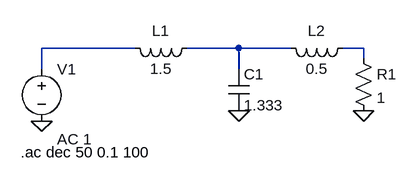
[diagram p0: schematic Circuito1.asc]
Circuito1.asc, the LTspice schematic file:
Version 4
SHEET 1 880 680
WIRE 176 96 32 96
WIRE 336 96 256 96
WIRE 416 96 336 96
WIRE 528 96 496 96
WIRE 528 112 528 96
WIRE 32 128 32 96
WIRE 336 128 336 96
FLAG 32 208 0
FLAG 336 192 0
FLAG 528 192 0
SYMBOL voltage 32 112 R0
WINDOW 123 24 124 Left 2
WINDOW 39 0 0 Left 0
SYMATTR Value2 AC 1
SYMATTR InstName V1
SYMATTR Value ""
SYMBOL ind 272 80 R90
WINDOW 0 5 56 VBottom 2
WINDOW 3 32 56 VTop 2
SYMATTR InstName L1
SYMATTR Value 1.5
SYMBOL ind 512 80 R90
WINDOW 0 5 56 VBottom 2
WINDOW 3 32 56 VTop 2
SYMATTR InstName L2
SYMATTR Value 0.5
SYMBOL cap 320 128 R0
SYMATTR InstName C1
SYMATTR Value 1.333
SYMBOL res 512 96 R0
SYMATTR InstName R1
SYMATTR Value 1
TEXT 0 256 Left 2 !.ac dec 50 0.1 100

The netlist it stands for:
* Circuito1.asc
V1 N001 0 AC 1
L1 N002 N001 1.5
L2 N003 N002 0.5
C1 N002 0 1.333
R1 N003 0 1
.ac dec 50 0.1 100
.backanno
.end